# Altium schematic sheet 12-MT7688AN DDR2 I_F-B.SchDoc
size 508 x 304 mm
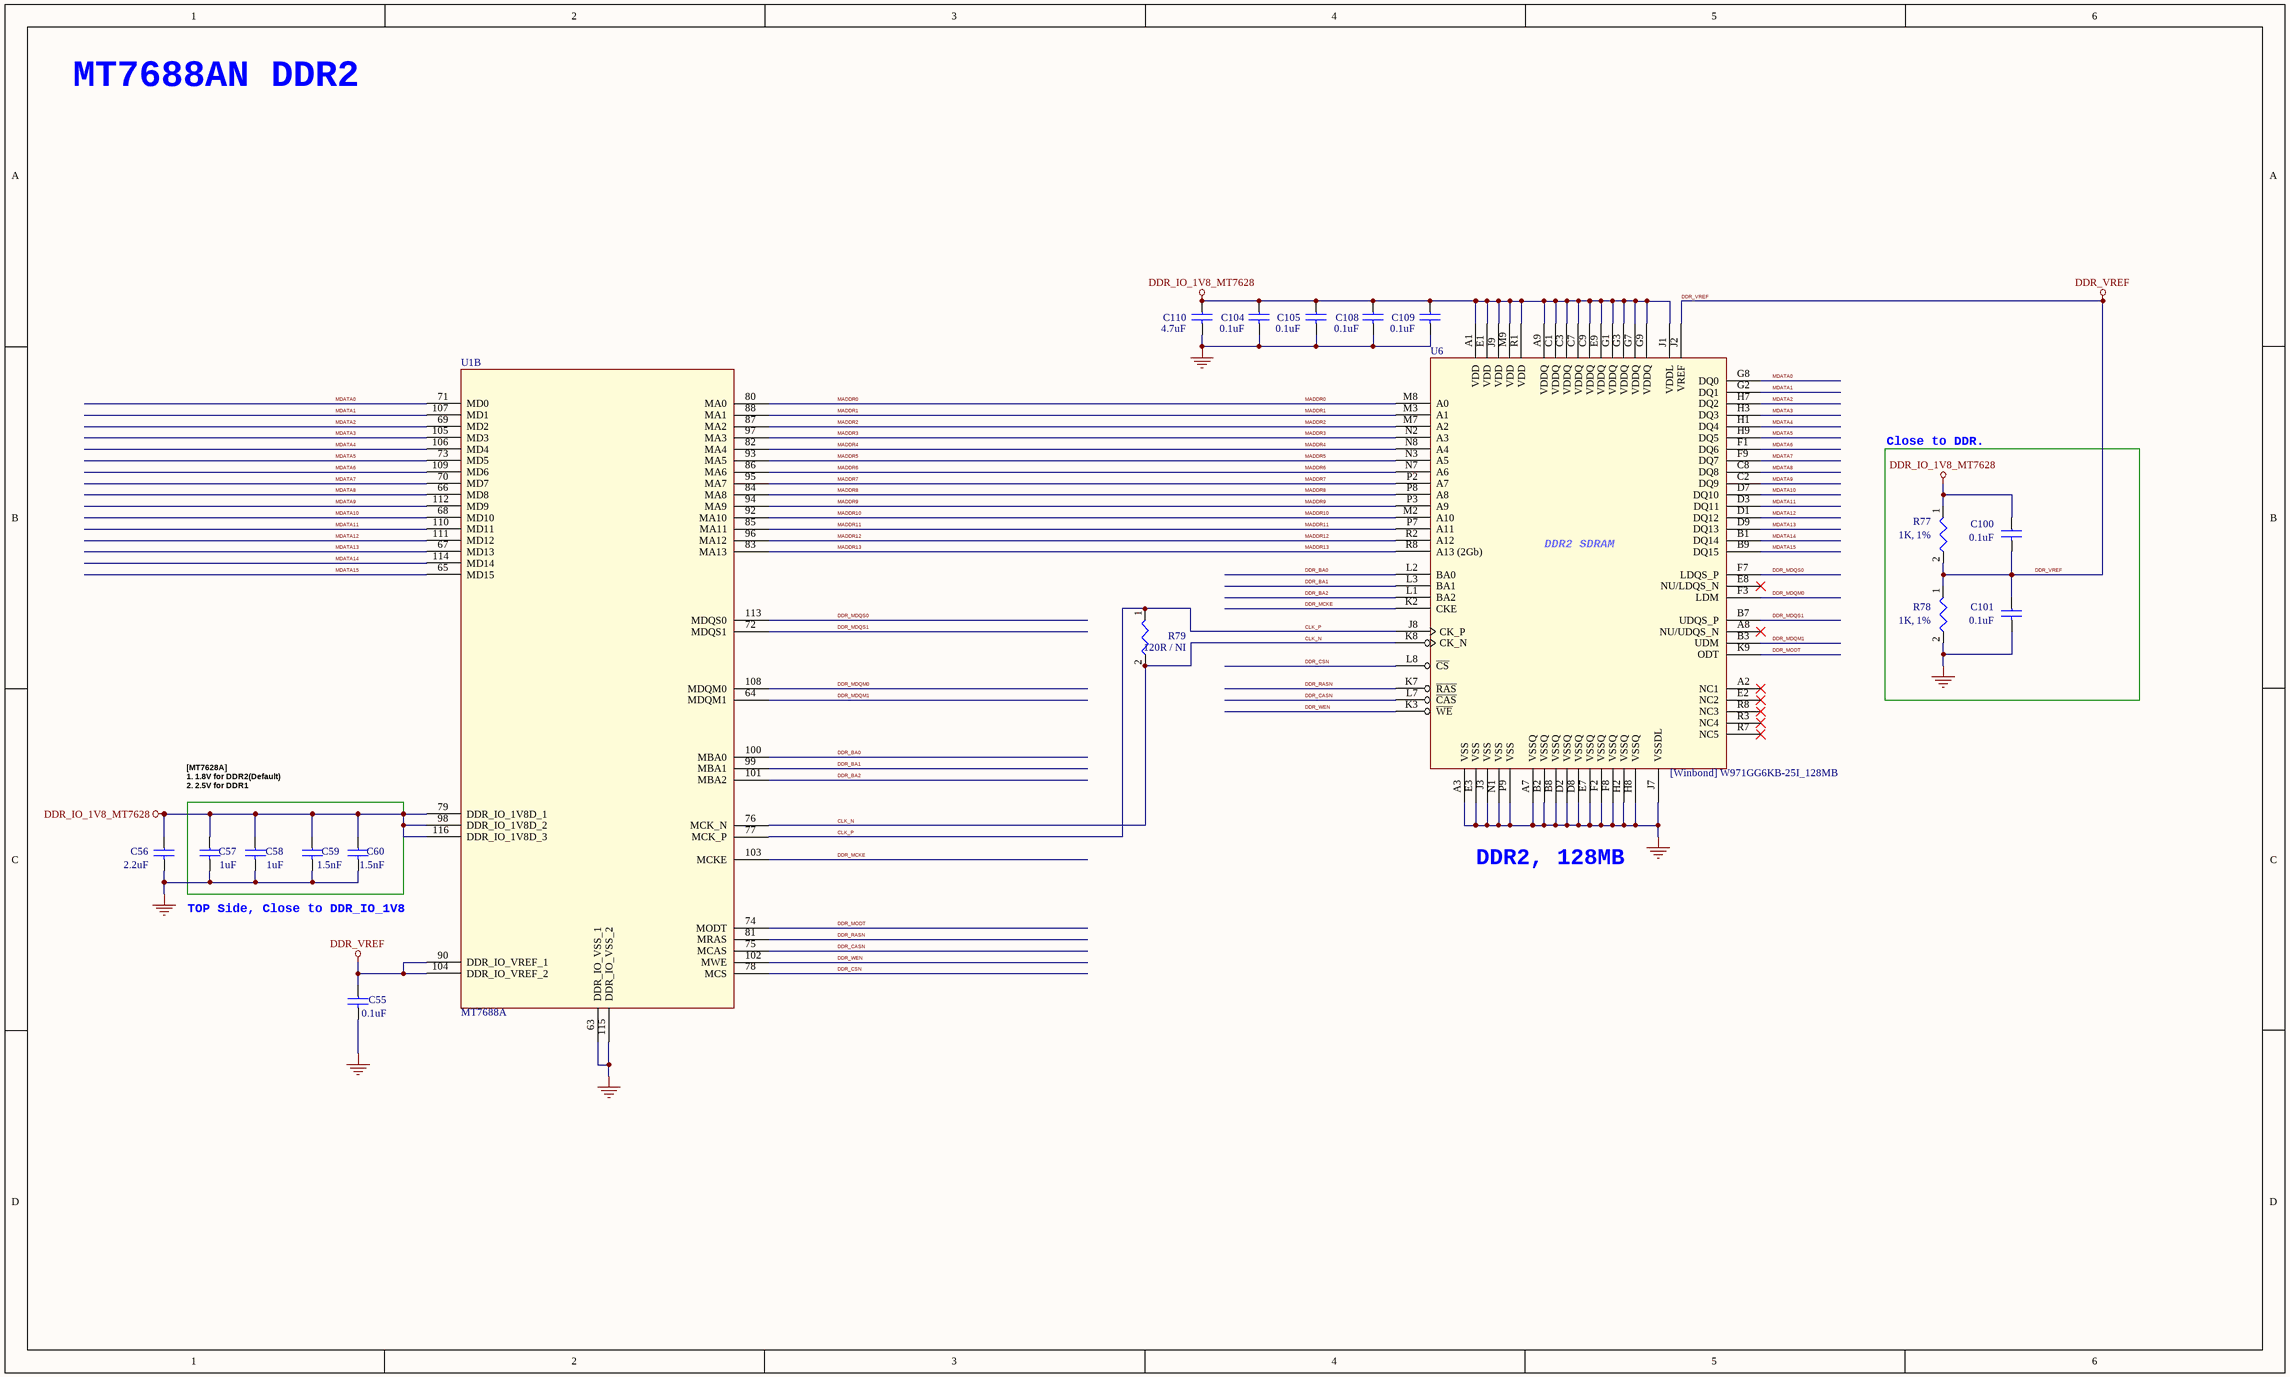
[diagram p0: 12-MT7688AN DDR2 I_F-B.SchDoc]

## Parts
C55  0.1uF  [RLC 0201 M35]
C56  2.2uF  [RLC 0402 M35]
C57  1uF  [RLC 0201 M35]
C58  1uF  [RLC 0201 M35]
C59  1.5nF  [RLC 0201 M35]
C60  1.5nF  [RLC 0201 M35]
C100  0.1uF  [RLC 0201 M35]
C101  0.1uF  [RLC 0201 M35]
C104  0.1uF  [RLC 0201 M35]
C105  0.1uF  [RLC 0201 M35]
C108  0.1uF  [RLC 0201 M35]
C109  0.1uF  [RLC 0201 M35]
C110  4.7uF  [RLC 0402 M35]
R77  1K, 1%  [RLC 0201 M35]
R78  1K, 1%  [RLC 0201 M35]
R79  120R / NI  [RLC 0201 M35]
U1  MT7688A  [MT7628AN$2F$DRQFN156$2F$SMD$2F$P0.5$2F$12X12]  (part B of 6)
U6  [Winbond] W971GG6KB-25I_128MB  [BGA84C80P9X15_800X1250X120]

## Blocks framed on the sheet
Close to DDR.: C100 C101 R77 R78

## Nets
DDR_IO_1V8_MT7628: C56.1 C57.1 C58.1 C59.1 C60.1 C100.1 C104.1 C105.1 C108.1 C109.1 C110.1 R77.1 U1.79(DDR_IO_1V8D_1) U1.98(DDR_IO_1V8D_2) U1.116(DDR_IO_1V8D_3) U6.A1(VDD) U6.A9(VDDQ) U6.C1(VDDQ) U6.C3(VDDQ) U6.C7(VDDQ) U6.C9(VDDQ) U6.E1(VDD) U6.E9(VDDQ) U6.G1(VDDQ) U6.G3(VDDQ) U6.G7(VDDQ) U6.G9(VDDQ) U6.J1(VDDL) U6.J9(VDD) U6.M9(VDD) U6.R1(VDD)
DDR_VREF: C55.1 C100.2 C101.1 R77.2 R78.1 U1.90(DDR_IO_VREF_1) U1.104(DDR_IO_VREF_2) U6.J2(VREF)
GND: C55.2 C56.2 C57.2 C58.2 C59.2 C60.2 C101.2 C104.2 C105.2 C108.2 C109.2 C110.2 R78.2 U1.63(DDR_IO_VSS_1) U1.115(DDR_IO_VSS_2) U6.A3(VSS) U6.A7(VSSQ) U6.B2(VSSQ) U6.B8(VSSQ) U6.D2(VSSQ) U6.D8(VSSQ) U6.E3(VSS) U6.E7(VSSQ) U6.F2(VSSQ) U6.F8(VSSQ) U6.H2(VSSQ) U6.H8(VSSQ) U6.J3(VSS) U6.J7(VSSDL) U6.N1(VSS) U6.P9(VSS)
CLK_N: R79.2 U1.76(MCK_N) U6.K8(CK_N)
CLK_P: R79.1 U1.77(MCK_P) U6.J8(CK_P)
DDR_BA0: U1.100(MBA0) U6.L2(BA0)
DDR_BA1: U1.99(MBA1) U6.L3(BA1)
DDR_BA2: U1.101(MBA2) U6.L1(BA2)
DDR_CASN: U1.75(MCAS) U6.L7(~{CAS})
DDR_CSN: U1.78(MCS) U6.L8(~{CS})
DDR_MCKE: U1.103(MCKE) U6.K2(CKE)
DDR_MDQM0: U1.108(MDQM0) U6.F3(LDM)
DDR_MDQM1: U1.64(MDQM1) U6.B3(UDM)
DDR_MDQS0: U1.113(MDQS0) U6.F7(LDQS_P)
DDR_MDQS1: U1.72(MDQS1) U6.B7(UDQS_P)
DDR_MODT: U1.74(MODT) U6.K9(ODT)
DDR_RASN: U1.81(MRAS) U6.K7(~{RAS})
DDR_WEN: U1.102(MWE) U6.K3(~{WE})
MADDR0: U1.80(MA0) U6.M8(A0)
MADDR1: U1.88(MA1) U6.M3(A1)
MADDR2: U1.87(MA2) U6.M7(A2)
MADDR3: U1.97(MA3) U6.N2(A3)
MADDR4: U1.82(MA4) U6.N8(A4)
MADDR5: U1.93(MA5) U6.N3(A5)
MADDR6: U1.86(MA6) U6.N7(A6)
MADDR7: U1.95(MA7) U6.P2(A7)
MADDR8: U1.84(MA8) U6.P8(A8)
MADDR9: U1.94(MA9) U6.P3(A9)
MADDR10: U1.92(MA10) U6.M2(A10)
MADDR11: U1.85(MA11) U6.P7(A11)
MADDR12: U1.96(MA12) U6.R2(A12)
MADDR13: U1.83(MA13) U6.R8(A13_(2Gb))
MDATA0: U1.71(MD0) U6.G8(DQ0)
MDATA1: U1.107(MD1) U6.G2(DQ1)
MDATA2: U1.69(MD2) U6.H7(DQ2)
MDATA3: U1.105(MD3) U6.H3(DQ3)
MDATA4: U1.106(MD4) U6.H1(DQ4)
MDATA5: U1.73(MD5) U6.H9(DQ5)
MDATA6: U1.109(MD6) U6.F1(DQ6)
MDATA7: U1.70(MD7) U6.F9(DQ7)
MDATA8: U1.66(MD8) U6.C8(DQ8)
MDATA9: U1.112(MD9) U6.C2(DQ9)
MDATA10: U1.68(MD10) U6.D7(DQ10)
MDATA11: U1.110(MD11) U6.D3(DQ11)
MDATA12: U1.111(MD12) U6.D1(DQ12)
MDATA13: U1.67(MD13) U6.D9(DQ13)
MDATA14: U1.114(MD14) U6.B1(DQ14)
MDATA15: U1.65(MD15) U6.B9(DQ15)

Not connected (* = marked no-connect by the designer): U6 A2(NC1)* A8(NU/UDQS_N)* E2(NC2)* E8(NU/LDQS_N)* R3(NC4)* R7(NC5)*

## Notes on the sheet
- MT7688AN DDR2
- [MT7628A]
  1. 1.8V for DDR2(Default)
  2. 2.5V for DDR1
- DDR2, 128MB
- TOP Side, Close to DDR_IO_1V8
- (in symbol W971GG6KB-25I) DDR2 SDRAM

## Library data of the parts
C55-C60 C100 C101 C104 C105 C108-C110 = CAP NP
R77-R79 = RES/0402_3
U1 = MT7620N-n_26
U6 = W971GG6KB-25I: DDR2, 128MB